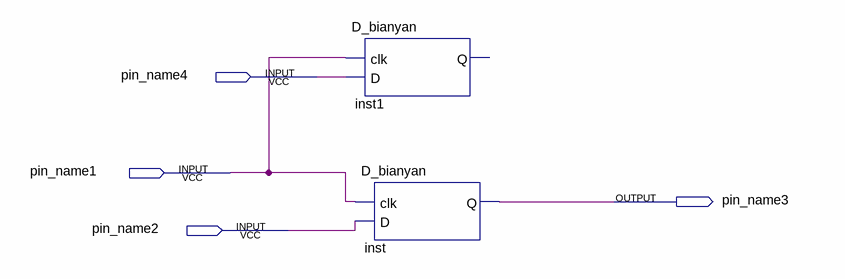
[diagram p0: schematic sheet]
// Quartus schematic Block1.bdf as structural Verilog: 2 symbols, 4 pins
module Block1 (
  input  pin_name4,
  input  pin_name1,
  input  pin_name2,
  output pin_name3
);

  D_bianyan inst1 (.clk(pin_name1), .D(pin_name4));  // open: Q
  D_bianyan inst (.clk(pin_name1), .D(pin_name2), .Q(pin_name3));
endmodule
